# Altium schematic sheet CAN.SchDoc
size A
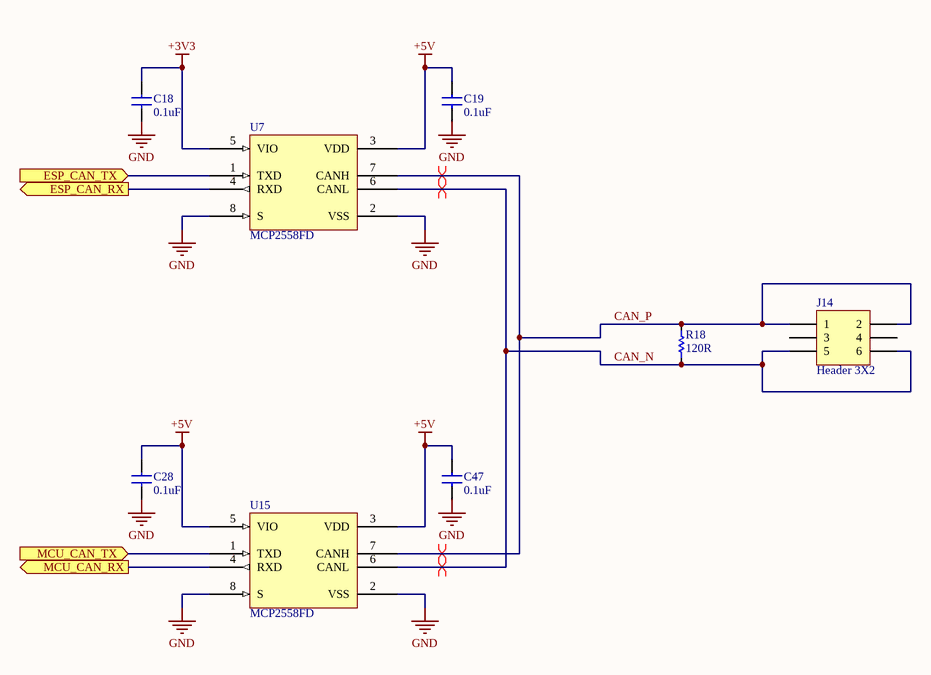
[diagram p0: CAN.SchDoc]

## Parts
C18  value 0.1uF  [0402_CAPACITOR]  (hidden comment: CAP 0.1uF 16V X7R)
C19  value 0.1uF  [0402_CAPACITOR]  (hidden comment: CAP 0.1uF 16V X7R)
C28  value 0.1uF  [0402_CAPACITOR]  (hidden comment: CAP 0.1uF 16V X7R)
C47  value 0.1uF  [0402_CAPACITOR]  (hidden comment: CAP 0.1uF 16V X7R)
J14  Header 3X2  [HDR2X3]
R18  value 120R  [0805_Resistor]  (hidden comment: R_0805_120R_1%)
U7  MCP2558FD  [SOIC-8]
U15  MCP2558FD  [SOIC-8]

## Ports
ESP_CAN_RX (out), ESP_CAN_TX (in), MCU_CAN_RX (out), MCU_CAN_TX (in)

## Nets
+3V3: C18.2 U7.5(VIO)
+5V: C19.2 C28.2 C47.2 U7.3(VDD) U15.3(VDD) U15.5(VIO)
GND: C18.1 C19.1 C28.1 C47.1 U7.2(VSS) U7.8(S) U15.2(VSS) U15.8(S)
CAN_N: J14.5 J14.6 R18.1 U7.6(CANL) U15.6(CANL)
CAN_P: J14.1 J14.2 R18.2 U7.7(CANH) U15.7(CANH)
ESP_CAN_RX: U7.4(RXD) ; port ESP_CAN_RX
ESP_CAN_TX: U7.1(TXD) ; port ESP_CAN_TX
MCU_CAN_RX: U15.4(RXD) ; port MCU_CAN_RX
MCU_CAN_TX: U15.1(TXD) ; port MCU_CAN_TX

Not connected (* = marked no-connect by the designer): J14 3 4

## Layout directives
differential pair: CAN_N, CAN_P

## Library data of the parts
C18 C19 C28 C47 = C_0402_0.1uF_16V_10%: CAP CERM 0.1uF 10% 16V 0402; Package: =SelectedPackage; Voltage: 16V; Temperature Coefficient: X7R; Supplier 1: Digi-Key; Supplier Part Number 1: 1276-1001-1-ND; Supplier 2: Digi-Key; Supplier Part Number 2: 587-1451-1-ND
J14 = Header 3X2: Header, 3-Pin, Dual row; LatestRevisionDate: 17-Jul-2002; LatestRevisionNote: Re-released for DXP Platform.; Publisher: Altium Limited
R18 = R_0805_generic_1%: Generic 0805 resistor (10.2R to 10M); Manufacturer: Yageo; Power Rating: 0.125W; Temperature Coefficient: ±100ppm/°C; Tolerance: ±1%; Voltage Rating: 150V; Operating Temperature: -55°C ~ 155°C; Manufacturer Part Number: ='RC0805FR-07'+ValueFormatted+'L'; HelpURL: https://www.digikey.com/products/en/resistors/chip-resistor-surface-mount/52?pv17=103&FV=fffc000d%2Cc0001%2C1c0002%2C1f140000%2Cffe00034&k=RC0805; ValueFormatted: =Copy(Copy(Value, 0, Pos('.', Value)-1)+Copy(Value, Length(Value), 1)+Copy(Value, Pos('.', Value)+1, Length(Value)-Pos('.', Value)-1),1,Pos('.',Value)*Length(Value))+Copy(Value,1,Length(Value)*(1-Pos('.',Value)))
U7 U15 = U_MCP2558FD: 1/1 Transceiver CANbus 8-SOIC; Manufacturer: Microchip; Manufacturer Part Number: MCP2558FD-H/SN; Receiver Hysteresis: 200mV; Supplier 1: Digi-Key; Supplier Part Number 1: MCP2558FD-H/SN-ND; Min Operating Temperature: -40°C; Max Operating Temperature: 150°C